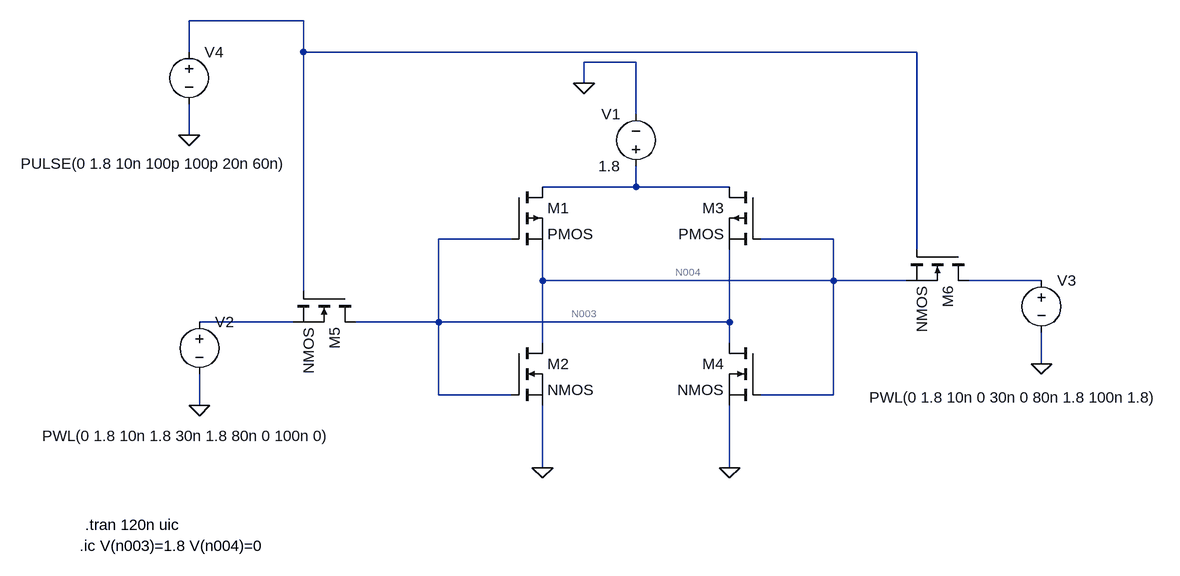
[diagram p0: schematic 6T_SRAM.asc]
6T_SRAM.asc, the LTspice schematic file:
Version 4.1
SHEET 1 1404 680
WIRE -240 -176 -416 -176
WIRE -416 -128 -416 -176
WIRE -240 -128 -240 -176
WIRE 704 -128 -240 -128
WIRE 272 -112 192 -112
WIRE 192 -80 192 -112
WIRE 272 -32 272 -112
WIRE -416 0 -416 -48
WIRE 272 80 272 48
WIRE 272 80 128 80
WIRE 416 80 272 80
WIRE 80 160 -32 160
WIRE 576 160 464 160
WIRE 704 176 704 -128
WIRE 128 224 128 176
WIRE 576 224 576 160
WIRE 576 224 128 224
WIRE 688 224 576 224
WIRE 896 224 784 224
WIRE -240 240 -240 -128
WIRE -256 288 -400 288
WIRE -32 288 -32 160
WIRE -32 288 -160 288
WIRE 416 288 416 176
WIRE 416 288 -32 288
WIRE 128 320 128 224
WIRE 416 320 416 288
WIRE 896 352 896 304
WIRE -32 400 -32 288
WIRE 80 400 -32 400
WIRE 576 400 576 224
WIRE 576 400 464 400
WIRE -400 416 -400 368
WIRE 128 512 128 416
WIRE 416 512 416 416
FLAG 128 512 0
FLAG 192 -80 0
FLAG 416 512 0
FLAG -416 0 0
FLAG -400 416 0
FLAG 896 352 0
SYMBOL pmos 80 80 R0
SYMATTR InstName M1
SYMBOL nmos 80 320 R0
SYMATTR InstName M2
SYMBOL voltage 272 64 R180
WINDOW 0 24 96 Left 2
WINDOW 3 24 16 Left 2
WINDOW 123 0 0 Left 0
WINDOW 39 0 0 Left 0
SYMATTR InstName V1
SYMATTR Value 1.8
SYMBOL pmos 464 80 M0
SYMATTR InstName M3
SYMBOL nmos 464 320 M0
SYMATTR InstName M4
SYMBOL nmos -160 240 R90
SYMATTR InstName M5
SYMBOL nmos 784 176 R90
SYMATTR InstName M6
SYMBOL voltage -400 272 R0
WINDOW 3 -242 191 Left 2
WINDOW 123 0 0 Left 0
WINDOW 39 0 0 Left 0
SYMATTR InstName V2
SYMATTR Value PWL(0 1.8 10n 1.8 30n 1.8 80n 0 100n 0)
SYMBOL voltage 896 208 R0
WINDOW 3 -265 196 Left 2
WINDOW 123 0 0 Left 0
WINDOW 39 0 0 Left 0
SYMATTR InstName V3
SYMATTR Value PWL(0 1.8 10n 0 30n 0 80n 1.8 100n 1.8)
SYMBOL voltage -416 -144 R0
WINDOW 3 -259 188 Left 2
WINDOW 123 0 0 Left 0
WINDOW 39 0 0 Left 0
SYMATTR InstName V4
SYMATTR Value PULSE(0 1.8 10n 100p 100p 20n 60n)
TEXT -584 632 Left 2 !.ic V(n003)=1.8 V(n004)=0
TEXT -576 600 Left 2 !.tran 120n uic

The netlist it stands for:
* 6T_SRAM.asc
M1 N002 N003 N004 N004 PMOS
M2 N004 N003 0 0 NMOS
V1 N002 0 1.8
M3 N002 N004 N003 N003 PMOS
M4 N003 N004 0 0 NMOS
M5 N003 N001 N006 N006 NMOS
M6 N005 N001 N004 N004 NMOS
V2 N006 0 PWL(0 1.8 10n 1.8 30n 1.8 80n 0 100n 0)
V3 N005 0 PWL(0 1.8 10n 0 30n 0 80n 1.8 100n 1.8)
V4 N001 0 PULSE(0 1.8 10n 100p 100p 20n 60n)
.model NMOS NMOS
.model PMOS PMOS
.lib standard.mos
.ic V(n003)=1.8 V(n004)=0
.tran 120n uic
.backanno
.end